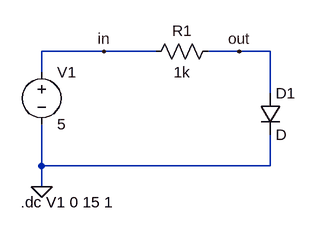
[diagram p0: schematic DC Sweep.asc]
DC Sweep.asc, the LTspice schematic file:
Version 4.1
SHEET 1 880 680
WIRE 128 64 32 64
WIRE 208 64 128 64
WIRE 336 64 288 64
WIRE 384 64 336 64
WIRE 32 96 32 64
WIRE 384 128 384 64
WIRE 32 240 32 176
WIRE 384 240 384 192
WIRE 384 240 32 240
WIRE 32 272 32 240
FLAG 32 272 0
FLAG 128 64 in
FLAG 336 64 out
SYMBOL voltage 32 80 R0
WINDOW 123 0 0 Left 0
WINDOW 39 0 0 Left 0
SYMATTR InstName V1
SYMATTR Value 5
SYMBOL res 304 48 R90
WINDOW 0 0 56 VBottom 2
WINDOW 3 32 56 VTop 2
SYMATTR InstName R1
SYMATTR Value 1k
SYMBOL diode 368 128 R0
SYMATTR InstName D1
TEXT 0 296 Left 2 !.dc V1 0 15 1

The netlist it stands for:
* DC Sweep.asc
V1 in 0 5
R1 out in 1k
D1 out 0 D
.model D D
.lib standard.dio
.dc V1 0 15 1
.backanno
.end